# Altium schematic sheet DATN2022.DataReader.SchDoc
size A3
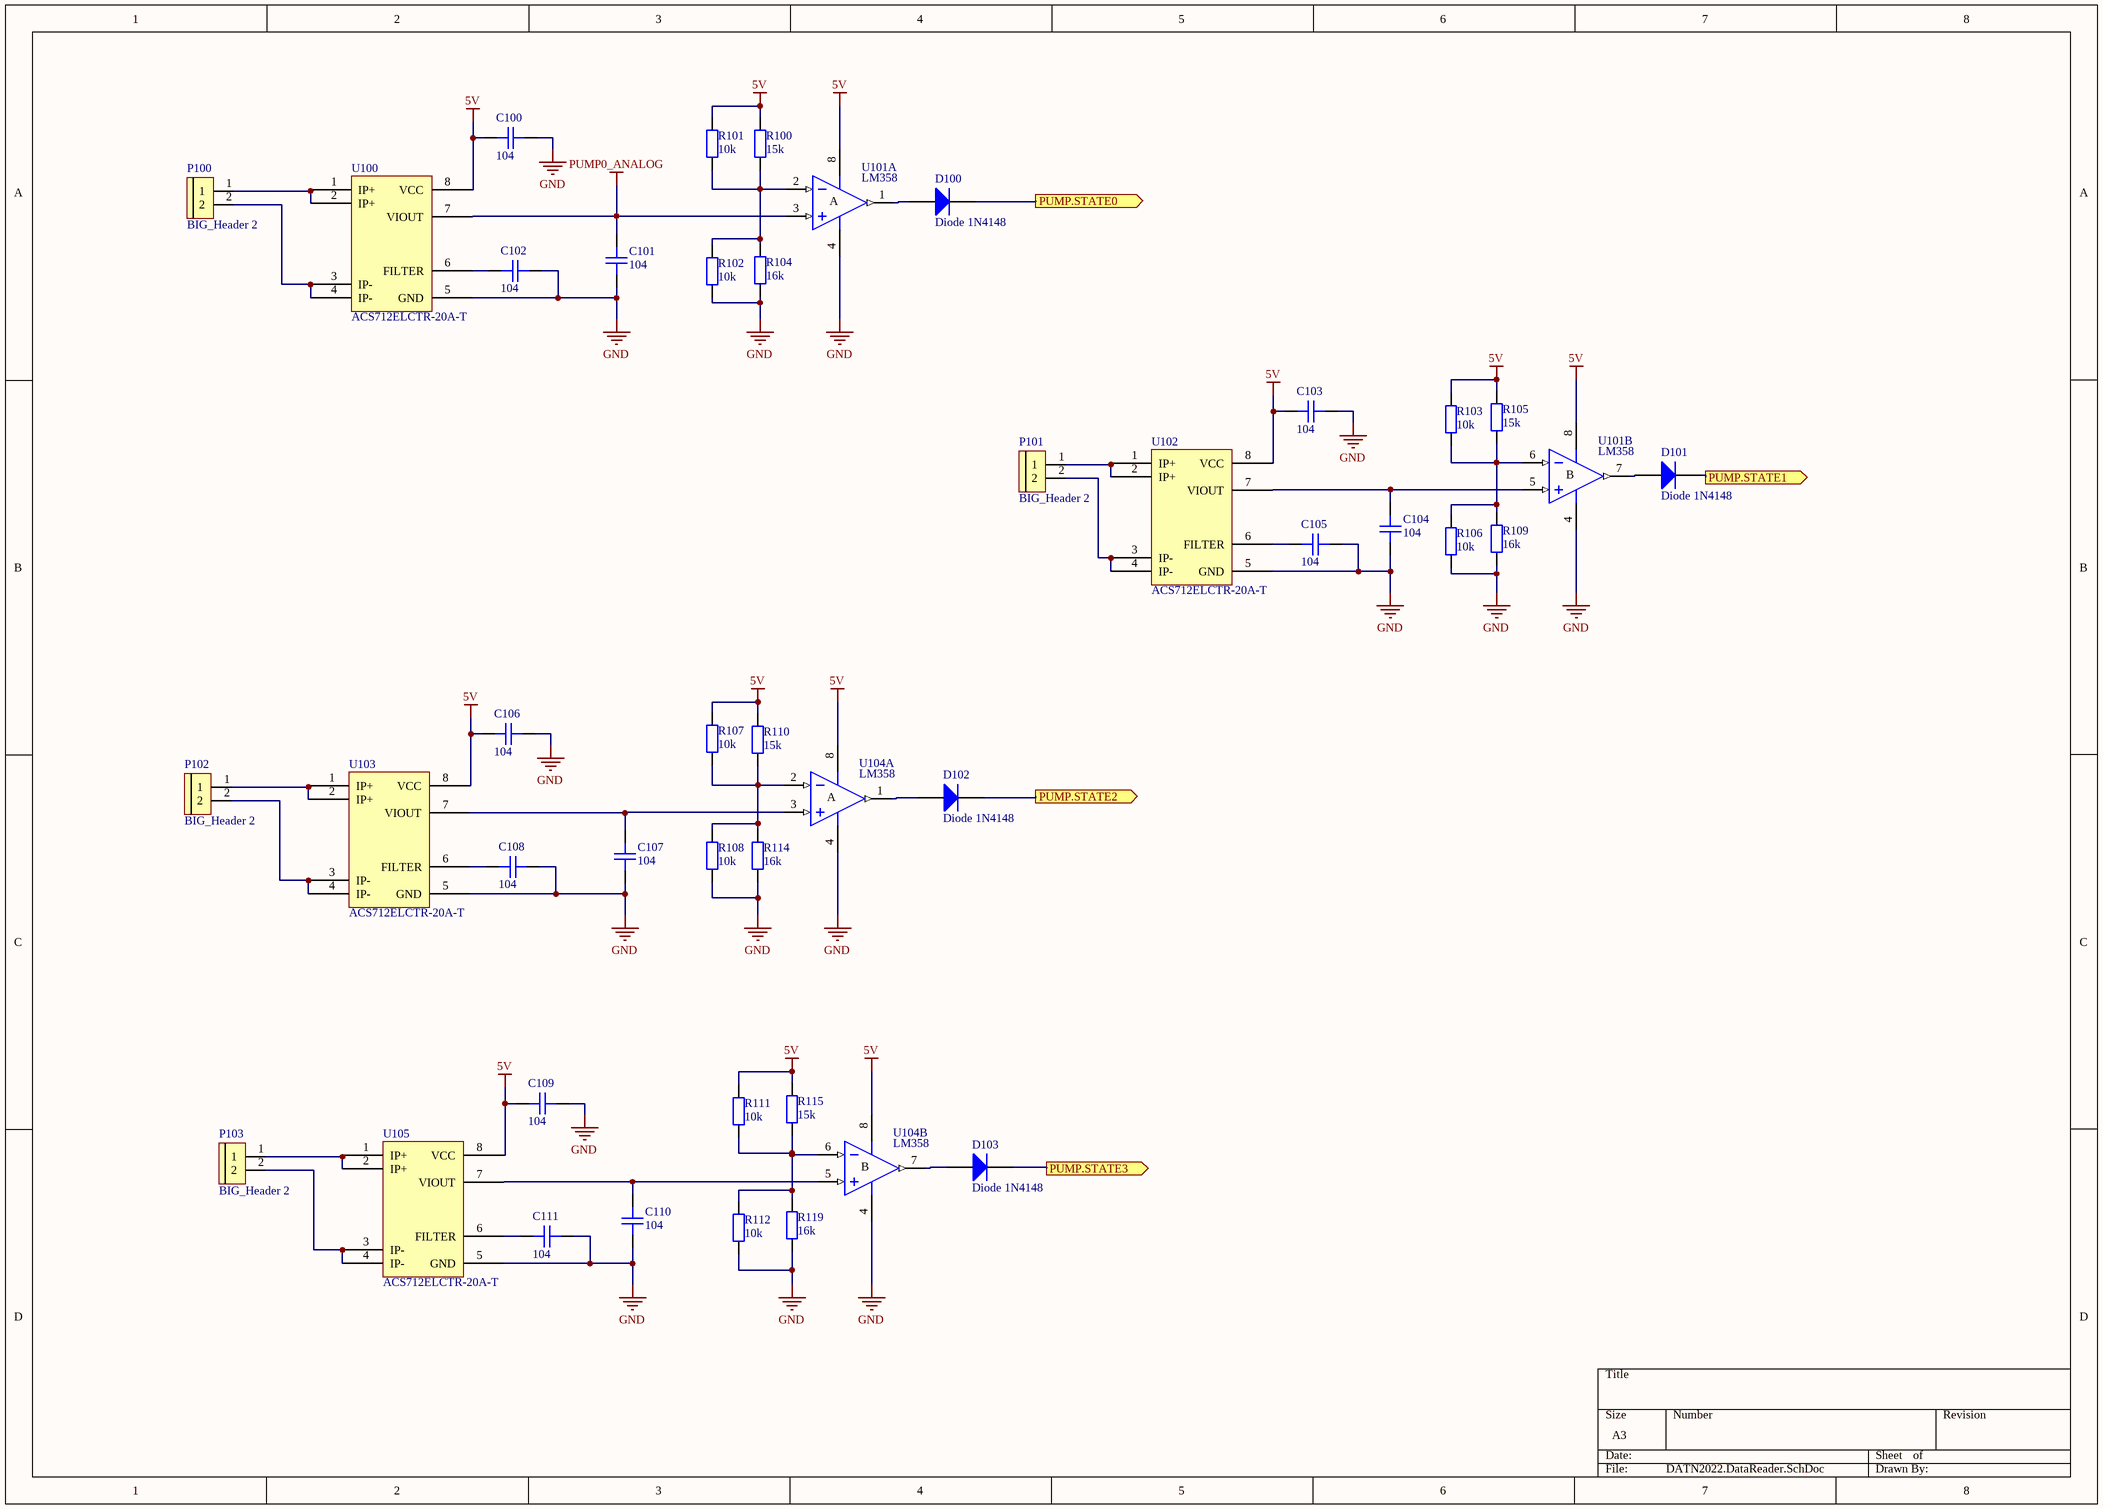
[diagram p0: DATN2022.DataReader.SchDoc]

## Parts
C100  104  [CAP_CERAMIC_0805(2012mm)]
C101  104  [CAP_CERAMIC_0805(2012mm)]
C102  104  [CAP_CERAMIC_0805(2012mm)]
C103  104  [CAP_CERAMIC_0805(2012mm)]
C104  104  [CAP_CERAMIC_0805(2012mm)]
C105  104  [CAP_CERAMIC_0805(2012mm)]
C106  104  [CAP_CERAMIC_0805(2012mm)]
C107  104  [CAP_CERAMIC_0805(2012mm)]
C108  104  [CAP_CERAMIC_0805(2012mm)]
C109  104  [CAP_CERAMIC_0805(2012mm)]
C110  104  [CAP_CERAMIC_0805(2012mm)]
C111  104  [CAP_CERAMIC_0805(2012mm)]
D100  Diode 1N4148  [DO214AC_SMA_1808]
D101  Diode 1N4148  [DO214AC_SMA_1808]
D102  Diode 1N4148  [DO214AC_SMA_1808]
D103  Diode 1N4148  [DO214AC_SMA_1808]
P100  BIG_Header 2  [KF128-2P]
P101  BIG_Header 2  [KF128-2P]
P102  BIG_Header 2  [KF128-2P]
P103  BIG_Header 2  [KF128-2P]
R100  15k  [RES_0805(2012)]
R101  10k  [RES_0805(2012)]
R102  10k  [RES_0805(2012)]
R103  10k  [RES_0805(2012)]
R104  16k  [RES_0805(2012)]
R105  15k  [RES_0805(2012)]
R106  10k  [RES_0805(2012)]
R107  10k  [RES_0805(2012)]
R108  10k  [RES_0805(2012)]
R109  16k  [RES_0805(2012)]
R110  15k  [RES_0805(2012)]
R111  10k  [RES_0805(2012)]
R112  10k  [RES_0805(2012)]
R114  16k  [RES_0805(2012)]
R115  15k  [RES_0805(2012)]
R119  16k  [RES_0805(2012)]
U100  ACS712ELCTR-20A-T  [SOIC8]
U101  LM358  [SOIC8]  (parts A,B of 2)
U102  ACS712ELCTR-20A-T  [SOIC8]
U103  ACS712ELCTR-20A-T  [SOIC8]
U104  LM358  [SOIC8]  (parts A,B of 2)
U105  ACS712ELCTR-20A-T  [SOIC8]

## Ports
PUMP.STATE0 (out), PUMP.STATE1 (out), PUMP.STATE2 (out), PUMP.STATE3 (out)

## Nets
5V: C100.2 C103.2 C106.2 C109.2 R100.2 R101.1 R103.1 R105.2 R107.1 R110.2 R111.1 R115.2 U100.8(VCC) U101.8(V+) U102.8(VCC) U103.8(VCC) U104.8(V+) U105.8(VCC)
GND: C100.1 C101.2 C102.2 C103.1 C104.2 C105.2 C106.1 C107.2 C108.2 C109.1 C110.2 C111.2 R102.2 R104.1 R106.2 R108.2 R109.1 R112.2 R114.1 R119.1 U100.5(GND) U101.4(V-) U102.5(GND) U103.5(GND) U104.4(V-) U105.5(GND)
PUMP0_ANALOG: C101.1 U100.7(VIOUT) U101.3(IN+)
PUMP.STATE0: D100.2(K) ; port PUMP.STATE0
PUMP.STATE1: D101.2(K) ; port PUMP.STATE1
PUMP.STATE2: D102.2(K) ; port PUMP.STATE2
PUMP.STATE3: D103.2(K) ; port PUMP.STATE3
NetC102_1: C102.1 U100.6(FILTER)
NetC104_1: C104.1 U101.5(IN+) U102.7(VIOUT)
NetC105_1: C105.1 U102.6(FILTER)
NetC107_1: C107.1 U103.7(VIOUT) U104.3(IN+)
NetC108_1: C108.1 U103.6(FILTER)
NetC110_1: C110.1 U104.5(IN+) U105.7(VIOUT)
NetC111_1: C111.1 U105.6(FILTER)
NetD100_1: D100.1(A) U101.1(OUT)
NetD101_1: D101.1(A) U101.7(OUT)
NetD102_1: D102.1(A) U104.1(OUT)
NetD103_1: D103.1(A) U104.7(OUT)
NetP100_1: P100.1 U100.1(IP+) U100.2(IP+)
NetP100_2: P100.2 U100.3(IP-) U100.4(IP-)
NetP101_1: P101.1 U102.1(IP+) U102.2(IP+)
NetP101_2: P101.2 U102.3(IP-) U102.4(IP-)
NetP102_1: P102.1 U103.1(IP+) U103.2(IP+)
NetP102_2: P102.2 U103.3(IP-) U103.4(IP-)
NetP103_1: P103.1 U105.1(IP+) U105.2(IP+)
NetP103_2: P103.2 U105.3(IP-) U105.4(IP-)
NetR100_1: R100.1 R101.2 R102.1 R104.2 U101.2(IN-)
NetR103_2: R103.2 R105.1 R106.1 R109.2 U101.6(IN-)
NetR107_2: R107.2 R108.1 R110.1 R114.2 U104.2(IN-)
NetR111_2: R111.2 R112.1 R115.1 R119.2 U104.6(IN-)

## Notes on the sheet
- (in symbol LM358, part A) A
- (in symbol LM358, part B) B

## Library data of the parts
C100-C111 = Cap Cer 0805 (2012): Capacitor Ceramic SMD 0805(2012); Value: 33p; Type: Tụ Ceramic; Published: 8-Jun-2000; LatestRevisionDate: 17-Jul-2002; LatestRevisionNote: Re-released for DXP Platform.; PackageReference: RAD-0.3; Publisher: Altium Limited; Component Type: Tụ Ceramic
D100-D103 = Diode 1N4448: High Conductance Fast Diode; Published: 8-Jun-2000; LatestRevisionDate: 17-Jul-2002; LatestRevisionNote: Re-released for DXP Platform.; DatasheetVersion: 1997; PackageReference: DO-35; Publisher: Altium Limited; PackageDescription: Diode, Axial; Body 3.8 x 1.9 mm (LxDia. max), Lead Dia. 0.53 mm (max); Code_JEDEC: DO-204-AH; ComponentLink1Description: Manufacturer Link; ComponentLink1URL: http://www.fairchildsemi.com/; ComponentLink2Description: Datasheet; ComponentLink2URL: http://www.fairchildsemi.com/ds/1N%2F1N4448.pdf
R100-R112 R114 R115 R119 = R0805: Resistor SMD 0805; Value: 0805; Published: 8-Jun-2000; LatestRevisionDate: 17-Jul-2002; LatestRevisionNote: Re-released for DXP Platform.; PackageReference: AXIAL-0.4; Publisher: Altium Limited
U100 U102 U103 U105 = ACS712ELCTR-20A-T: Current meter IC
U101 U104 = LM358: Dual Operational Amplifier (JFET); Manufacturer: Texas Instruments; Manufacturer Part Number: LM358DR; Amplifier Type: General Purpose; Number of Circuits: 2; Slew Rate: 0.3 V/µs; Gain Bandwidth Product: 700kHz; Current - Input Bias: 20nA; Voltage - Input Offset: 3mV; Current - Supply: 1mA; Current - Output / Channel: 30mA; Voltage - Supply, Single/Dual (±): 3 V ~ 32 V, ±1.5 V ~ 16 V; Creator: Nguyen Ba Bien; Supplier 1: Digi-Key; RoHS: RoHS Compliant; Category: Integrated Circuits (ICs); Stock 1: 13315; Pricing 1: 1=0.55, 10=0.386, 25=0.3176, 100=0.2537, 250=0.1848, 500=0.15008, 1000=0.11536 (USD); Packaging: Cut Tape (CT); Output Type: -; -3db Bandwidth: -; Operating Temperature: 0°C ~ 70°C; Mounting Type: Surface Mount; Package / Case: 8-SOIC (0.154", 3.90mm Width); Supplier Device Package: 8-SOIC; ComponentLink1URL: http://www.ti.com/lit/ds/symlink/lm358.pdf; ComponentLink1Description: http://www.ti.com/lit/ds/symlink/lm358.pdf; Supplier Part Number 1: 296-1014-1-ND